# EAGLE schematic basic_attiny85 (EAGLE 9.6.2)
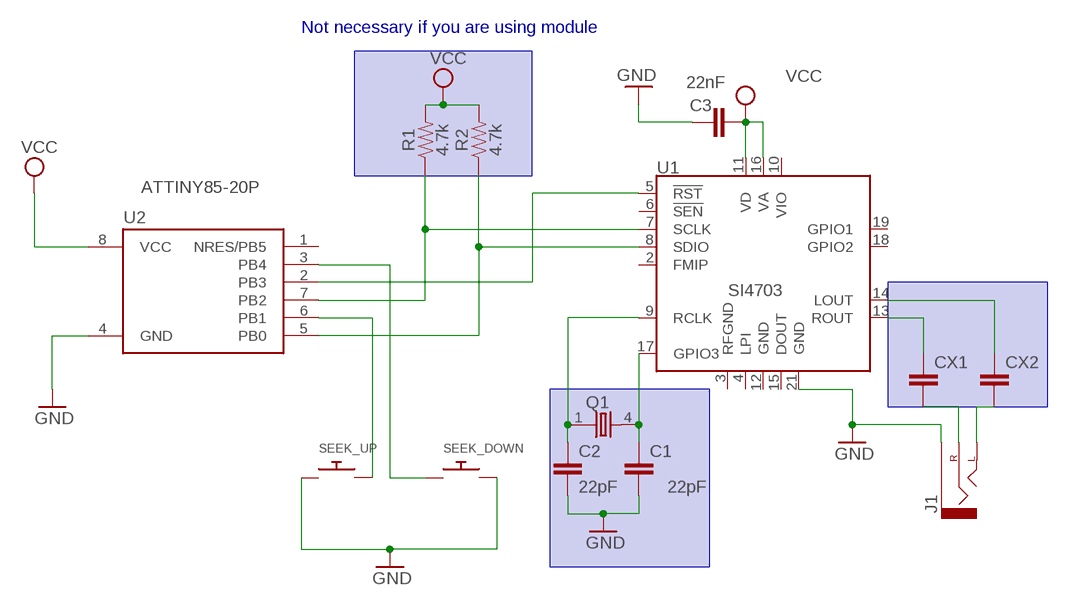
[diagram p0: schematic, sheet 1]

## Parts
C1  22pF  C2,5-3  [C2.5-3]
C2  22pF  C2,5-3  [C2.5-3]
C3  22nF  C2,5-3  [C2.5-3]
CX1  CXXC10B6  [XC10B6]
CX2  CXXC10B6  [XC10B6]
J1  AUDIO_JACK_2.5MM_HOLESONLY  [STEREOJACK2.5MM_SPECIAL_HOLES-ONLY]
Q1  86SMX  [86SMX]
R1  4.7k  4.7KOHM-0603-1/10W-1%  [0603]
R2  4.7k  4.7KOHM-0603-1/10W-1%  [0603]
SEEK_DOWN  SWITCH_PUSHBUTTONC&K_KSS  [BTN_CK_KSS]
SEEK_UP  SWITCH_PUSHBUTTONC&K_KSS  [BTN_CK_KSS]
U1  SI4703  [QFN-20-3X3MM]
U2  ATTINY85-20P  [PDIP08_300MIL]

## Nets
GND: C1.2 C2.2 C3.1 J1.RING1(SLEEVE) SEEK_DOWN.P$2 SEEK_UP.P$1 U1.21(GND) U2.4(GND)
N$1: R1.1 U1.7(SCLK) U2.7(PB2)
N$2: R2.1 U1.8(SDIO) U2.5(PB0)
N$3: U1.5(!RST) U2.2(PB3)
N$4: C1.1 Q1.4 U1.17(GPIO3)
N$5: C2.1 Q1.1 U1.9(RCLK)
N$6: SEEK_UP.P$2 U2.6(PB1)
N$7: SEEK_DOWN.P$1 U2.3(PB4)
N$16: CX1.1 U1.13(ROUT)
N$19: CX2.1 U1.14(LOUT)
N$20: CX1.2 J1.TIP(RIGHT)
N$21: CX2.2 J1.SHIELD(LEFT)
VCC: C3.2 R1.2 R2.2 U1.11(VD) U1.16(VA) U2.8(VCC)
Unconnected: U1.2(FMIP) U1.3(RFGND) U1.4(LPI) U1.6(!SEN) U1.10(VIO) U1.12(GND) U1.15(DOUT) U1.18(GPIO2) U1.19(GPIO1) U2.1(NRES/PB5)

## Notes on the sheet
- Not necessary if you are using module

## Library data of the parts
C1-C3 = capacitor-wima:C: CAPACITOR naming: grid - package width
CX1 CX2 = rcl:CX: X CAPACITOR for power line; SPICEPREFIX: C
J1 = SparkFun-Connectors:AUDIO_JACK_2.5MM: Audio Jack 2.5mm variants of PTH and SMT audio jacks. SparkFun Products: SparkFun PicoBoard <https://www.sparkfun.com/products/11888>- 2.5mm SMD
Q1 = crystal:86SMX: CRYSTAL; MF: C-MAC FREQUENCY PRODUCTS LTD; MPN: XTAL003321- 86SMX; OC_FARNELL: 6344914; OC_NEWARK: 01H9866
R1 R2 = SparkFun-Resistors:4.7KOHM: 4.7kΩ resistor A resistor is a passive two-terminal electrical component that implements electrical resistance as a circuit element. Resistors act to reduce current flow, and, at the same time, act to lower voltage levels within circuits. - Wikipedia; PROD_ID: RES-07857
SEEK_DOWN SEEK_UP = adafruit:SWITCH_PUSHBUTTON: Buttons SOFTTOUCHSMD_SJ - Soft touch temporary push button (Super Junk Akihabara) Compatible with SKPMANE010 [Mouser: 688-SKPMAN] C&K_KSS = Digikey: KSS221GLFS
U1 = SI4703:SI4703: Silicon Labs Si4703 FM Tuner Beyond enabling you to tune in to FM radio stations, the Si4703 is also capable of detecting and processing both Radio Data Service (RDS) and Radio Broadcast Data Service (RBDS) information. The Si4703 even does a very good job of filtering and carrier detection. It also enables data such as the station ID and song name to be displayed to the user. SparkFun Products SparkFun FM Tuner Evaluation Board - Si4703 <https://www.sparkfun.com/products/12938> (WRL-12938) SparkFun FM Tuner Basic Breakout - Si4703 <https://www.sparkfun.com/products/11083> (WRL-11083) FabFM Radio Kit <https://www.sparkfun.com/products/11043> (KIT-11043); AVAILABILITY: Unavailable; DESCRIPTION: - Tuner For Use With Si4703; MF: SparkFun Electronics; MP: SI4703; PACKAGE: UFQFN-20 SparkFun Electronics; PRICE: None
U2 = _hhn_attiny25_45_85:ATTINY85*: ATMEL ATtiny 85 Packages: P = PDIP 08 30mil S = SOIC 08 EIAJ 208mil Technologies Note: for complete ordering code (temp. range, finish, tape&reel etc.) see www.atmel.com • Supply Voltage: V = (1.8…5.5)V | [blank] = (2.7…5.5)V • Speed: 10 = 10 MHz | 20 = 20 MHz Author: Dipl.-Ing. FH Rainer Bayer HHN Hochschule Heilbronn (Heilbronn University), rainer.bayer@hs-heilbronn.de Ingenieurbüro ing-rb, mail@ing-rb.de